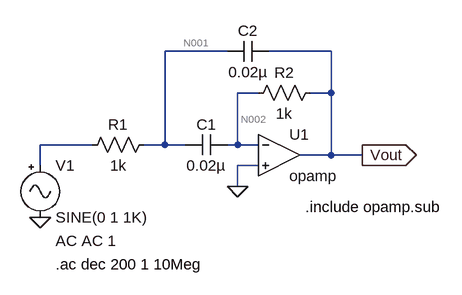
[diagram p0: schematic MFIG bandpass.asc]
MFIG bandpass.asc, the LTspice schematic file:
Version 4
SHEET 1 880 680
WIRE 320 48 224 48
WIRE 480 48 384 48
WIRE 368 112 336 112
WIRE 480 112 480 48
WIRE 480 112 448 112
WIRE 112 192 32 192
WIRE 224 192 224 48
WIRE 224 192 192 192
WIRE 256 192 224 192
WIRE 336 192 336 112
WIRE 336 192 320 192
WIRE 368 192 336 192
WIRE 480 208 480 112
WIRE 480 208 432 208
WIRE 528 208 480 208
WIRE 32 224 32 192
WIRE 368 224 336 224
WIRE 336 256 336 224
FLAG 528 208 Vout
IOPIN 528 208 Out
FLAG 32 304 0
FLAG 336 256 0
SYMBOL res 208 176 R90
WINDOW 0 0 56 VBottom 2
WINDOW 3 32 56 VTop 2
SYMATTR InstName R1
SYMATTR Value 1k
SYMBOL cap 384 32 R90
WINDOW 0 0 32 VBottom 2
WINDOW 3 32 32 VTop 2
SYMATTR InstName C2
SYMATTR Value 0.02µ
SYMBOL Misc\\signal 32 208 R0
WINDOW 123 24 132 Left 2
WINDOW 39 0 0 Left 0
SYMATTR Value2 AC AC 1
SYMATTR InstName V1
SYMBOL OpAmps\\opamp 400 144 R0
SYMATTR InstName U1
SYMBOL res 464 96 R90
WINDOW 0 0 56 VBottom 2
WINDOW 3 32 56 VTop 2
SYMATTR InstName R2
SYMATTR Value 1k
SYMBOL cap 320 176 R90
WINDOW 0 0 32 VBottom 2
WINDOW 3 32 32 VTop 2
SYMATTR InstName C1
SYMATTR Value 0.02µ
TEXT 56 376 Left 2 !.ac dec 200 1 10Meg
TEXT 440 288 Left 2 !.include opamp.sub

The netlist it stands for:
* MFIG bandpass.asc
R1 N001 N003 1k
C2 Vout N001 0.02µ
V1 N003 0 SINE(0 1 1K) AC AC 1
XU1 N002 0 Vout opamp Aol=100K GBW=10Meg  ; pins invin noninvin out
R2 Vout N002 1k
C1 N002 N001 0.02µ
.ac dec 200 1 10Meg
.include opamp.sub
.backanno
.end

* Results of the author's LTspice run, read from the files saved beside the schematic
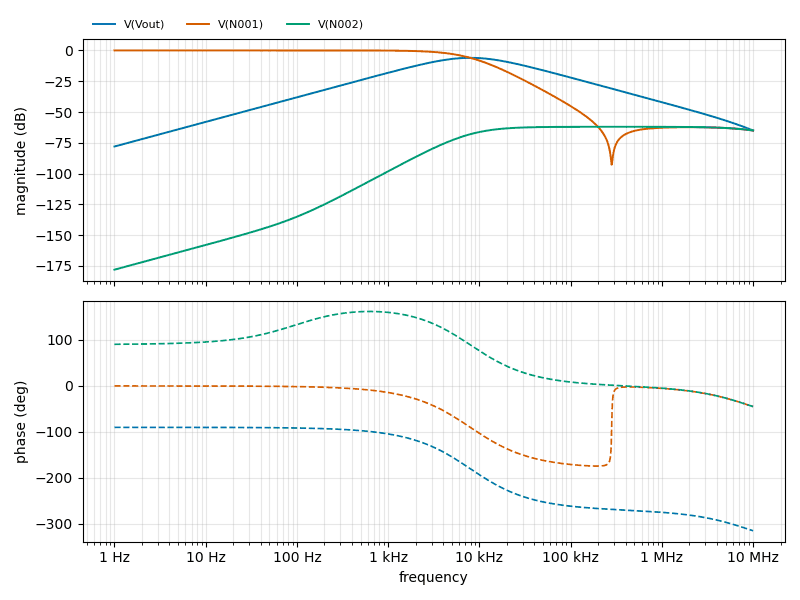
[diagram p1: AC Analysis of MFIG bandpass.asc, plotted from the saved traces]
* AC Analysis, 1 run:
*   V(Vout): -78.02 dB at 1 Hz, -65.00 dB at 10 MHz, peak -6.02 dB at 7.943 kHz, 3 dB below the peak at 3.296 kHz and 19.2 kHz
*   V(N001): -0.00 dB at 1 Hz, -65.00 dB at 10 MHz, peak -0.00 dB at 1 Hz, 3 dB below the peak at 5.119 kHz
*   V(N002): -178.00 dB at 1 Hz, -65.00 dB at 10 MHz, peak -62.00 dB at 335 kHz, 3 dB below the peak at 12.33 kHz